# EAGLE design BusBreakout_I2C (EAGLE 8.5.1)
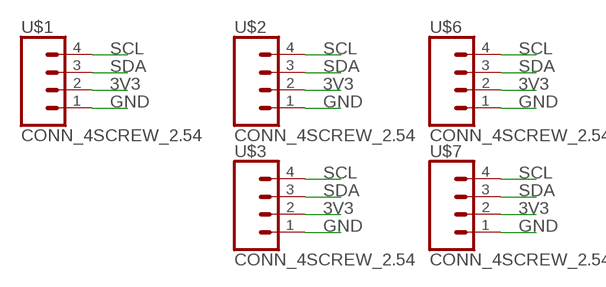
[diagram p0: schematic, sheet 1]

## Parts
U$1  CONN_4SCREW_2.54  [1X04]
U$2  CONN_4SCREW_2.54  [1X04]
U$3  CONN_4SCREW_2.54  [1X04]
U$6  CONN_4SCREW_2.54  [1X04]
U$7  CONN_4SCREW_2.54  [1X04]

## Nets
3V3: U$1.2 U$2.2 U$3.2 U$6.2 U$7.2
GND: U$1.1 U$2.1 U$3.1 U$6.1 U$7.1
SCL: U$1.4 U$2.4 U$3.4 U$6.4 U$7.4
SDA: U$1.3 U$2.3 U$3.3 U$6.3 U$7.3

## Library data of the parts
U$1-U$3 U$6 U$7 = bschulz:CONN_4: Genaric 4 pin connector

## Board
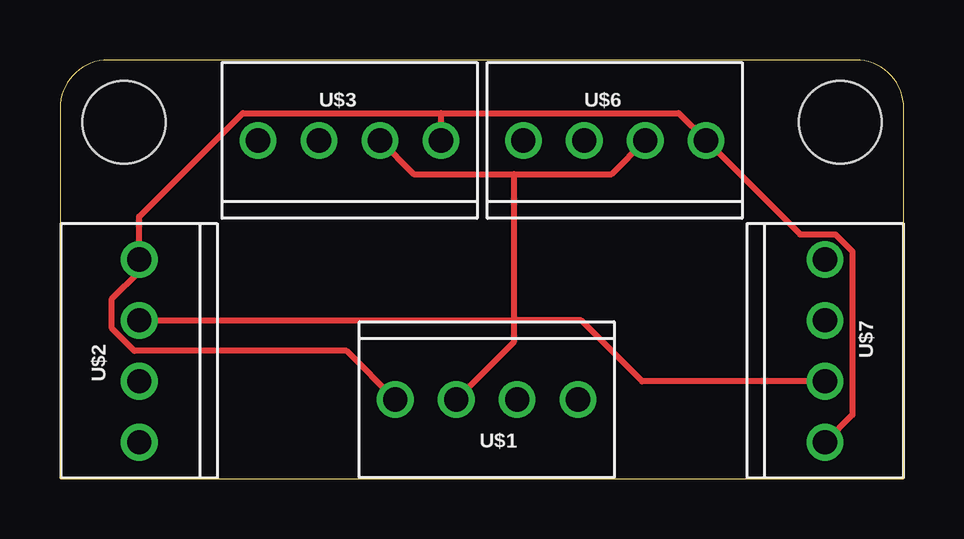
[diagram p1: board, top side]
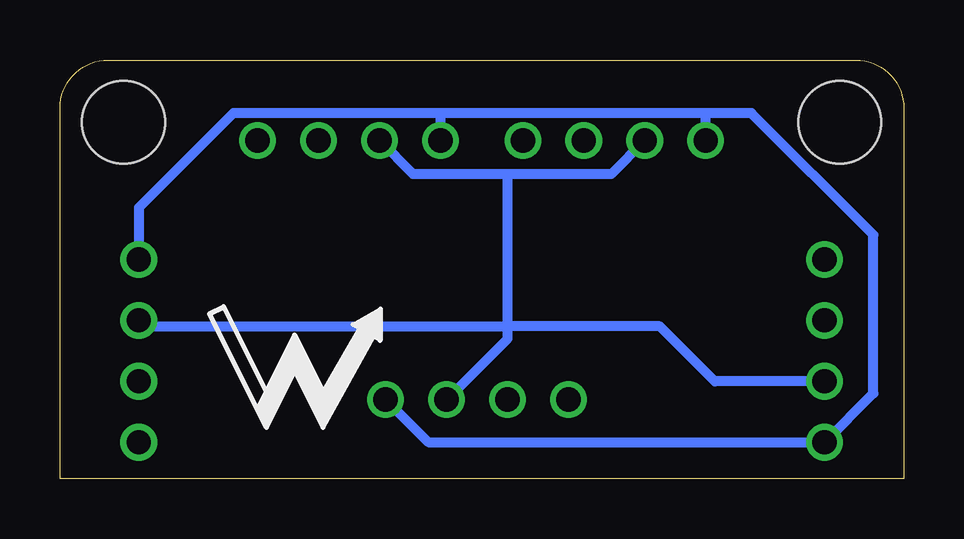
[diagram p2: board, bottom side, seen from below]

Size 35.16 x 17.45 mm. Coordinates in mm from the lower left corner, seen from the top.
Outline: 0,0 35.16,0 35.16,15.45 arc90 33.16,17.45 2,17.45 arc90 0,15.45 0,0
Copper layers (1*16): Top 0.035559375mm / dielectric 1.6mm / Bottom 0.035559375mm
Design rules "BayArea-2layer": minimum track width 6mil, minimum drill 10mil, track to track 6mil, track to pad 6mil, pad to pad 6mil, via to via 6mil, smd to smd 6mil, copper to edge 15mil, drill to drill 6mil, minimum pad ring 6mil, minimum via ring 6mil, stop-mask expansion 2.5mil, vias tented up to drill 0mil, thermal gap 10mil
Holes 3.45 mm at 32.51,14.86 2.67,14.86

### Footprints (pad centres in the part's own frame; a part is rotated, then mirrored left to right if it is on the bottom)
1X04 = drill 1.016: 1 -3.81,0; 2 -1.27,0; 3 1.27,0; 4 3.81,0

### Placement (x,y rotation side)
U$1  17.78,3.3 180 top
U$2  3.3,5.33 90 top
U$3  12.06,14.1 0 top
U$4  [NWLOGO_MED]  25.4,5.08 0 bottom
U$6  23.11,14.1 0 top
U$7  31.88,5.33 270 top

### Tracks (layer width: path | path; a pad name or v marks a point on that pad's centre or on a via)
3V3
  Bottom 0.406: U$3.2 12.19,12.7 16.51,12.7 | U$6.2 20.45,12.7 16.51,12.7 | U$1.2 16.51,5.84 16.51,6.35 | 16.51,6.35 16.51,12.7 | U$7.2 31.62,6.35 16.51,6.35 | U$2.2 7.87,4.06 10.16,6.35 16.51,6.35
GND
  Bottom 0.406: U$7.1 31.88,11.3 27.94,15.24 19.43,15.24 | 8.38,15.24 6.35,15.24 1.27,10.16 1.27,3.56 U$2.1 19.81,1.52 U$1.1 | 8.38,15.24 19.43,15.24 | U$3.1 8.26,15.11 8.38,15.24 | U$6.1 19.3,15.11 19.43,15.24
SCL
  Top 0.254: U$1.4 11.94,5.33 3.1,5.33 2.16,6.27 2.16,7.49 3.3,8.64 U$2.4 3.3,10.92 7.62,15.24 15.88,15.24 | 15.88,15.24 25.78,15.24 U$6.4 30.84,10.19 32.31,10.19 33.02,9.47 33.02,2.67 U$7.4 | U$3.4 15.88,15.24
SDA
  Top 0.254: 13.21,13.97 U$3.3 14.73,12.7 18.92,12.7 | U$6.3 22.99,12.7 18.92,12.7 | U$1.3 18.92,5.71 18.92,6.6 | 18.92,6.6 18.92,12.7 | U$2.3 18.92,6.6 | U$7.3 24.26,4.06 21.72,6.6 18.92,6.6

### Text on the board
tDocu: GND | VCC | SDA | SCL | GND | VCC | SDA | SCL | SCL | GND | SDA | SCL | SDA | VCC | GND | VCC | VCC | SDA | SCL | GND
bDocu: Project Heptapod / ---------------------- / Designed by / Northern Widget and / University of Minnesota